# Altium schematic sheet S7CAS-PLEIADES-CARTE-MERE_Pxx_PHY.SchDoc
size Tabloid; SheetNumber: 9; SheetTotal: 18; Sheet_Name: PHY; Size: 11x17
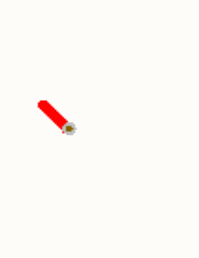
[diagram p0: S7CAS-PLEIADES-CARTE-MERE_Pxx_PHY.SchDoc, left]
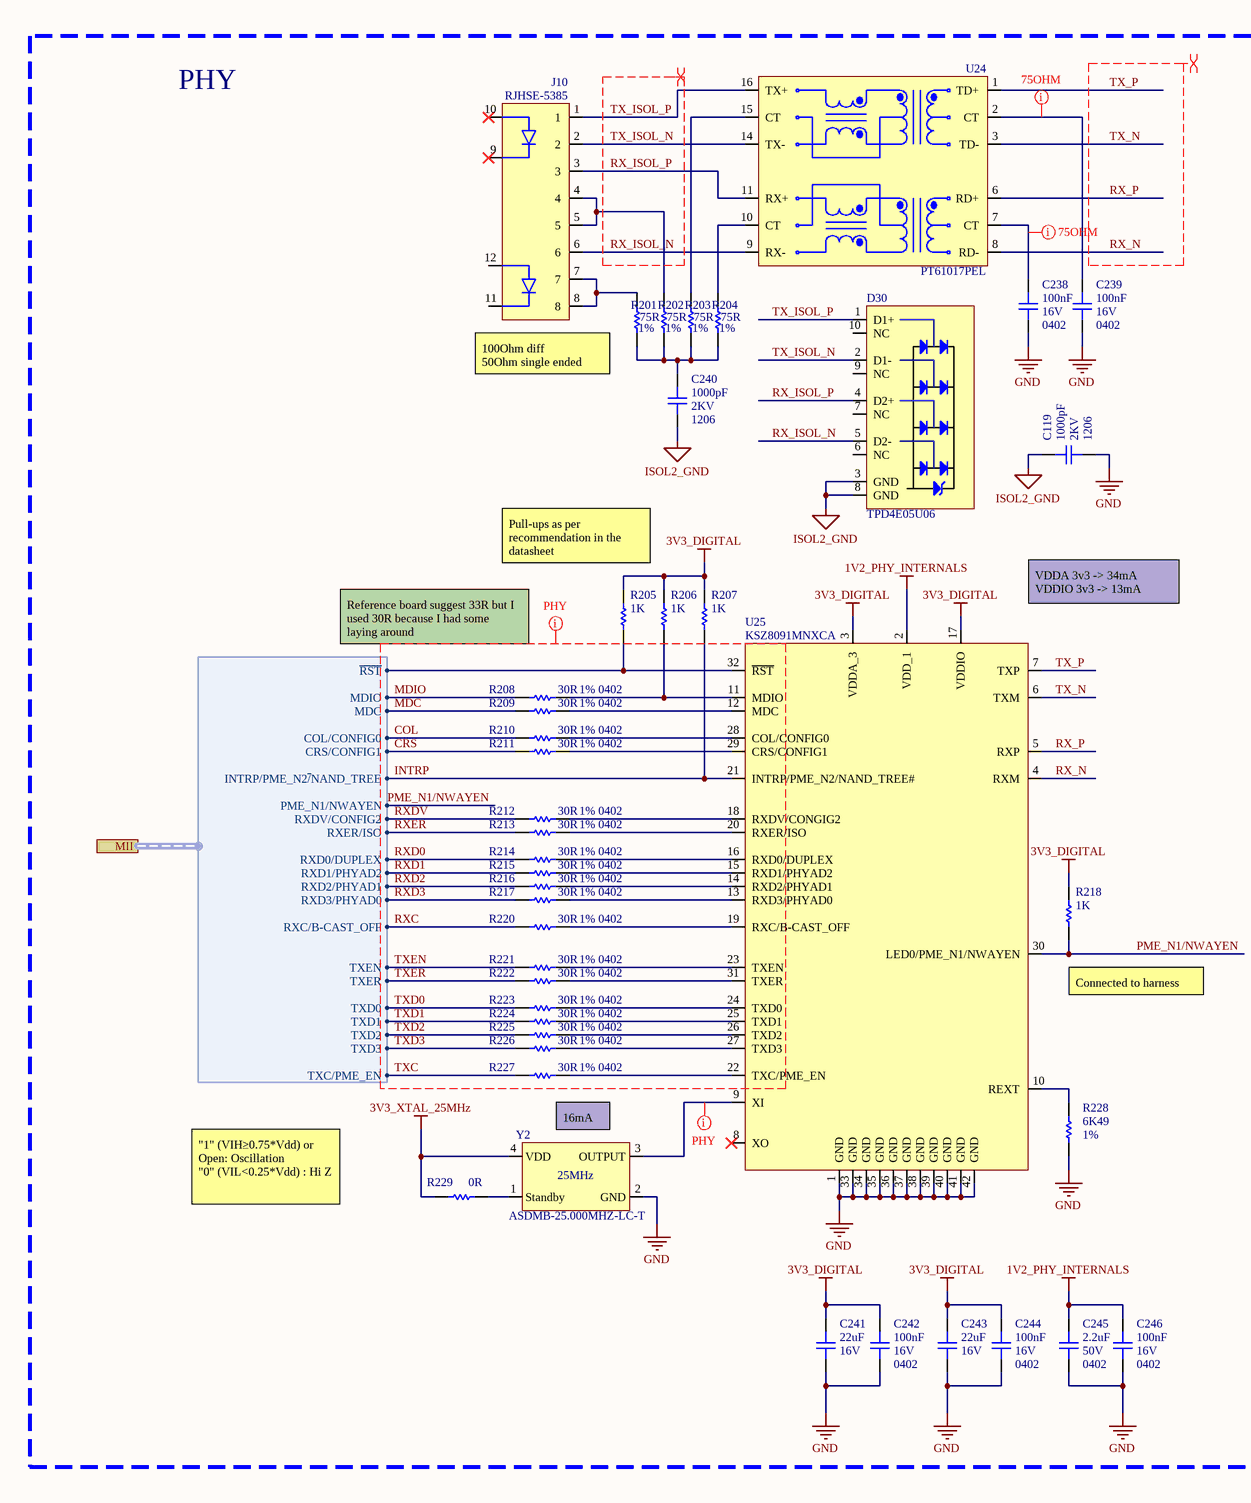
[diagram p1: S7CAS-PLEIADES-CARTE-MERE_Pxx_PHY.SchDoc, middle]
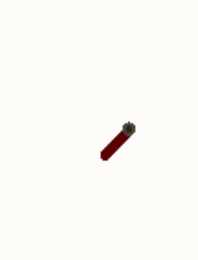
[diagram p2: S7CAS-PLEIADES-CARTE-MERE_Pxx_PHY.SchDoc, right]

## Parts
C119  value 1000pF  Voltage: 2KV  Package: 1206  [CAP_1206]  (hidden comment: CAP - 1206)
C238  value 100nF  Voltage: 16V  [CAP_0402]  (hidden comment: 0402)
C239  value 100nF  Voltage: 16V  [CAP_0402]  (hidden comment: 0402)
C240  value 1000pF  Voltage: 2KV  Package: 1206  [CAP_1206]  (hidden comment: CAP - 1206)
C241  value 22uF  Voltage: 16V  [CAP_1206]  (hidden comment: CAP - 1206)
C242  value 100nF  Voltage: 16V  [CAP_0402]  (hidden comment: 0402)
C243  value 22uF  Voltage: 16V  [CAP_1206]  (hidden comment: CAP - 1206)
C244  value 100nF  Voltage: 16V  [CAP_0402]  (hidden comment: 0402)
C245  value 2.2uF  Voltage: 50V  [CAP_0402]  (hidden comment: 0402)
C246  value 100nF  Voltage: 16V  [CAP_0402]  (hidden comment: 0402)
D30  TPD4E05U06  [TVS_DATA_TPD4E05U06]
J10  RJHSE-5385  [CONN_ETHERNET_RJHSE-5385]
R201  value 75R  Precision: 1%  [RES_0402]  (hidden comment: RES - 0603)
R202  value 75R  Precision: 1%  [RES_0402]  (hidden comment: RES - 0603)
R203  value 75R  Precision: 1%  [RES_0402]  (hidden comment: RES - 0603)
R204  value 75R  Precision: 1%  [RES_0402]  (hidden comment: RES - 0603)
R205  value 1K  [RES_0402]  (hidden comment: RES - 0603)
R206  value 1K  [RES_0402]  (hidden comment: RES - 0603)
R207  value 1K  [RES_0402]  (hidden comment: RES - 0603)
R208  value 30R  Package: 0402  Precision: 1%  [RES_0402]  (hidden comment: RES - 0603)
R209  value 30R  Package: 0402  Precision: 1%  [RES_0402]  (hidden comment: RES - 0603)
R210  value 30R  Package: 0402  Precision: 1%  [RES_0402]  (hidden comment: RES - 0603)
R211  value 30R  Package: 0402  Precision: 1%  [RES_0402]  (hidden comment: RES - 0603)
R212  value 30R  Package: 0402  Precision: 1%  [RES_0402]  (hidden comment: RES - 0603)
R213  value 30R  Package: 0402  Precision: 1%  [RES_0402]  (hidden comment: RES - 0603)
R214  value 30R  Package: 0402  Precision: 1%  [RES_0402]  (hidden comment: RES - 0603)
R215  value 30R  Package: 0402  Precision: 1%  [RES_0402]  (hidden comment: RES - 0603)
R216  value 30R  Package: 0402  Precision: 1%  [RES_0402]  (hidden comment: RES - 0603)
R217  value 30R  Package: 0402  Precision: 1%  [RES_0402]  (hidden comment: RES - 0603)
R218  value 1K  [RES_0402]  (hidden comment: RES - 0603)
R220  value 30R  Package: 0402  Precision: 1%  [RES_0402]  (hidden comment: RES - 0603)
R221  value 30R  Package: 0402  Precision: 1%  [RES_0402]  (hidden comment: RES - 0603)
R222  value 30R  Package: 0402  Precision: 1%  [RES_0402]  (hidden comment: RES - 0603)
R223  value 30R  Package: 0402  Precision: 1%  [RES_0402]  (hidden comment: RES - 0603)
R224  value 30R  Package: 0402  Precision: 1%  [RES_0402]  (hidden comment: RES - 0603)
R225  value 30R  Package: 0402  Precision: 1%  [RES_0402]  (hidden comment: RES - 0603)
R226  value 30R  Package: 0402  Precision: 1%  [RES_0402]  (hidden comment: RES - 0603)
R227  value 30R  Package: 0402  Precision: 1%  [RES_0402]  (hidden comment: RES - 0603)
R228  value 6K49  Precision: 1%  [RES_0402]  (hidden comment: RES - 0402)
R229  value 0R  [RES_0402]  (hidden comment: RES - 0603)
U24  PT61017PEL  [ISO_PT61017PEL]
U25  KSZ8091MNXCA  [COM_ETH_PHY_KSZ8091MNXCA]
Y2  ASDMB-25.000MHZ-LC-T  [OSC_ASDMB-25.000MHZ-LC-T]

## Blocks framed on the sheet
PHY: C119 C238-C246 D30 J10 R201-R218 R220-R229 U24 U25 Y2

## Ports
MII (harness MII - Harness, see S7CAS-PLEIADES-CARTE-MERE_Pxx_FPGA_bank0_1_5[1B])

## Harnesses
MII - Harness: ~{RST}, MDIO, MDC, COL/CONFIG0, CRS/CONFIG1, INTRP/PME_N2~{/}NAND_TREE, PME_N1/NWAYEN, RXDV/CONFIG2, RXER/ISO, RXD0/DUPLEX, RXD1/PHYAD2, RXD2/PHYAD1, RXD3/PHYAD0, RXC/B-CAST_OFF, TXEN, TXER, TXD0, TXD1, TXD2, TXD3, TXC/PME_EN

## Nets
1V2_PHY_INTERNALS: C245.2 C246.2 U25.2(VDD_1)
3V3_DIGITAL: C241.2 C242.2 C243.2 C244.2 R205.2 R206.2 R207.2 R218.2 U25.3(VDDA_3) U25.17(VDDIO)
3V3_XTAL_25MHz: R229.2 Y2.4(VDD)
GND: C119.1 C238.1 C239.1 C241.1 C242.1 C243.1 C244.1 C245.1 C246.1 R228.1 U25.1(GND) U25.33(GND) U25.34(GND) U25.35(GND) U25.36(GND) U25.37(GND) U25.38(GND) U25.39(GND) U25.40(GND) U25.41(GND) U25.42(GND) Y2.2(GND)
ISOL2_GND: C119.2 C240.1 D30.3(GND) D30.8(GND)
COL: R210.1 ; port MII.COL/CONFIG0
CRS: R211.1 ; port MII.CRS/CONFIG1
INTRP: R207.1 U25.21(INTRP/PME_N2/NAND_TREE#) ; port MII.INTRP/PME_N2~{/}NAND_TREE
MDC: R209.1 ; port MII.MDC
MDIO: R208.1 ; port MII.MDIO
PME_N1/NWAYEN: R218.1 U25.30(LED0/PME_N1/NWAYEN) ; port MII.PME_N1/NWAYEN
RX_ISOL_N: D30.5(D2-) J10.6 U24.9(RX-)
RX_ISOL_P: D30.4(D2+) J10.3 U24.11(RX+)
RX_N: U24.8(RD-) U25.4(RXM)
RX_P: U24.6(RD+) U25.5(RXP)
RXC: R220.1 ; port MII.RXC/B-CAST_OFF
RXD0: R214.1 ; port MII.RXD0/DUPLEX
RXD1: R215.1 ; port MII.RXD1/PHYAD2
RXD2: R216.1 ; port MII.RXD2/PHYAD1
RXD3: R217.1 ; port MII.RXD3/PHYAD0
RXDV: R212.1 ; port MII.RXDV/CONFIG2
RXER: R213.1 ; port MII.RXER/ISO
TX_ISOL_N: D30.2(D1-) J10.2 U24.14(TX-)
TX_ISOL_P: D30.1(D1+) J10.1 U24.16(TX+)
TX_N: U24.3(TD-) U25.6(TXM)
TX_P: U24.1(TD+) U25.7(TXP)
TXC: R227.1 ; port MII.TXC/PME_EN
TXD0: R223.1 ; port MII.TXD0
TXD1: R224.1 ; port MII.TXD1
TXD2: R225.1 ; port MII.TXD2
TXD3: R226.1 ; port MII.TXD3
TXEN: R221.1 ; port MII.TXEN
TXER: R222.1 ; port MII.TXER
NetC238_2: C238.2 U24.7(CT)
NetC239_2: C239.2 U24.2(CT)
NetC240_2: C240.2 R201.1 R202.1 R203.1 R204.1
NetJ10_4: J10.4 J10.5 R202.2
NetJ10_7: J10.7 J10.8 R201.2
NetR203_2: R203.2 U24.15(CT)
NetR204_2: R204.2 U24.10(CT)
NetR205_1: R205.1 U25.32(~{RST}) ; port MII.~{RST}
NetR206_1: R206.1 R208.2 U25.11(MDIO)
NetR209_2: R209.2 U25.12(MDC)
NetR210_2: R210.2 U25.28(COL/CONFIG0)
NetR211_2: R211.2 U25.29(CRS/CONFIG1)
NetR212_2: R212.2 U25.18(RXDV/CONGIG2)
NetR213_2: R213.2 U25.20(RXER/ISO)
NetR214_2: R214.2 U25.16(RXD0/DUPLEX)
NetR215_2: R215.2 U25.15(RXD1/PHYAD2)
NetR216_2: R216.2 U25.14(RXD2/PHYAD1)
NetR217_2: R217.2 U25.13(RXD3/PHYAD0)
NetR220_2: R220.2 U25.19(RXC/B-CAST_OFF)
NetR221_2: R221.2 U25.23(TXEN)
NetR222_2: R222.2 U25.31(TXER)
NetR223_2: R223.2 U25.24(TXD0)
NetR224_2: R224.2 U25.25(TXD1)
NetR225_2: R225.2 U25.26(TXD2)
NetR226_2: R226.2 U25.27(TXD3)
NetR227_2: R227.2 U25.22(TXC/PME_EN)
NetR228_2: R228.2 U25.10(REXT)
NetR229_1: R229.1 Y2.1(Standby)
NetU25_9: U25.9(XI) Y2.3(OUTPUT)

Not connected (* = marked no-connect by the designer): D30 6(NC) 7(NC) 9(NC) 10(NC); J10 9(LED1_K)* 10(LED1_A)* 11(LED2_K) 12(LED2_A); U25 8(XO)*

## Layout directives
differential pair; differential pair class ETH_DIFF_PAIR; differential pair class ETH75OHM; net class eth_diff: RX_N, RX_P, TX_N, TX_P
differential pair; differential pair class ETH_ISOL_DIFF_PAIR; differential pair class ETH75OHM; net class eth_diff: RX_ISOL_N, RX_ISOL_P, TX_ISOL_N, TX_ISOL_P
net class MII_TRANSMISSION_LINE: COL, CRS, INTRP, MDC, MDIO, NetU25_9, PME_N1/NWAYEN, RXC, RXD0, RXD1, RXD2, RXD3, RXDV, RXER, TXC, TXD0, TXD1, TXD2, TXD3, TXEN, TXER
net class 75OHM: NetC238_2, NetC239_2

## Notes on the sheet
- 100Ohm diff
  50Ohm single ended
- Pull-ups as per recommendation in the datasheet
- Reference board suggest 33R but I used 30R because I had some laying around
- (near U25) VDDA 3v3 -> 34mA
  VDDIO 3v3 -> 13mA
- Connected to harness
- 16mA
- "1" (VIH≥0.75*Vdd) or Open: Oscillation
  "0" (VIL<0.25*Vdd) : Hi Z
- Sheet Name
- Project Title
- Global Project
- Size
- Group
- Revision
- Date
- Sheet
- of
- Filename
- Designers

## Library data of the parts
C119 C240 C241 C243 = CAP - 1206: Precision: 10%; Current: *; CreatedBy: Jonathan Bouchard; Power: *; Supplier 1: Arrow Electronics
  C119 C240: Supplier Part Number 1: 1206GC102KAT1A
  C241 C243: Package: 1206; Supplier Part Number 1: CL31A226MOCLNNC
C238 C239 C242 C244-C246 = CAP - 0603: CAP - 0402; Precision: 10%; Current: *; CreatedBy: Jonathan Bouchard; Power: *; Package: 0402; Supplier 1: Arrow Electronics
  C238 C239 C242 C244 C246: Supplier Part Number 1: CL10B104KO8NNNC
  C245: Supplier Part Number 1: GRM188R61H225KE11D
D30 = TVS_DATA_TPD4E05U06: TVS - TVS DIODE 5.5VWM 14VC - 10SON; Manufacturer #1: Texas Instruments; Part Number #1: TPD4E05U06DQAR; Current Rating: 2.5A (8/20µs); Power Max: 40 W (peak); Value: 4 unidirectionnal channels; Voltage rating: 6V (Breakdown); Polarized: YES; Magnetic Material: UNKNOWN; GRAMS Lib Spec: 2.8; Manufacturer #2: *; Part Number #2: *; HelpURL: http://www.ti.com/lit/ds/symlink/tpd4e05u06.pdf; Supplier 1: Digi-Key; Supplier Part Number 1: 296-35765-1-ND; Note: *; Assembly Type: SMD; Temperature: -40°C ~ 125°C; Package: 10-USON; CreatedBy/Date: Olivier Bernard / 12/3/2018; Tolerance: *; VerifiedBy: Caroline Paulin / 4 juillet 2018; Cryo: UNKNOWN
J10 = CONN_ETHERNET_RJHSE-5385: CONN - MOD JACK RJ45 R/A ETHERNET - TH; Mfg: Amphenol; Voltage: *; Current: *; Power: *; Mfg Part Number: RJHSE-5385; HelpURL: https://www.amphenolcanada.com/ProductSearch/drawings/AC/RJHSE538X.pdf; CreatedBy: Jonathan Bouchard; Temperature: -55°C ~ 85°C; Value: *; Precision: *; Package: TH-12; Supplier 1: Digikey; Supplier Part Number 1: RJHSE-5385-ND
R201-R204 R208-R217 R220-R227 = RES - 0603: RES - 0402; Current: *; CreatedBy: Jonathan Bouchard; Supplier 1: Arrow Electronics
  R201-R204: Package: 0402; Supplier Part Number 1: RMCF0603FT75R0
  R208-R217 R220-R227: Supplier Part Number 1: RMCF0603FT30R0
R205-R207 R218 R229 = RES - 0603: RES - 0402; Precision: 1%; Current: *; CreatedBy: Jonathan Bouchard; Package: 0402; Supplier 1: Arrow Electronics
  R205-R207 R218: Supplier Part Number 1: RMCF0603FT1K00
  R229: Supplier Part Number 1: RMCF0603ZT0R00
R228 = RES - 0402: Voltage: 50V; Power: 1/16W; Current: *; CreatedBy: Jonathan Bouchard; Package: 0402; Supplier 1: Mouser; Supplier Part Number 1: 652-CR0402-FX6491GLF
U24 = ISO_PT61017PEL: ISO - 350µH LAN 10/100 Base-T Pulse Transformer 1CT:1CT Surface Mount; GRAMS Lib Spec: 2.7; Supplier 1: Arrow Electronics; Supplier Part Number 1: PT61017PEL
U25 = COM_ETH_PHY_KSZ8091MNXCA: COM - ETHERNET PHY 10/100 - QFN-32; Voltage: 1.8V, 2.5V, 3.3V; Mfg: Micrel; Current: *; Power: *; Mfg Part Number: KSZ8091MNXCA; HelpURL: http://ww1.microchip.com/downloads/en/DeviceDoc/00002275A.pdf; CreatedBy: Jonathan Bouchard; Temperature: 0°C ~ 70°C; Value: *; Precision: *; Package: QFN-32; Supplier 1: Digikey; Supplier Part Number 1: 576-4356-ND
Y2 = OSC_ASDMB-25.000MHZ-LC-T: OSC - 25MHz XO (Standard) LVCMOS - 4-SMD, No Lead; Manufacturer #1: Abracon LLC; Tolerance: ±50ppm; Voltage Rating: 1.8V ~ 3.3V; GRAMS Lib Spec: 2.8; Magnetic Material: Unknown; Polarized: Yes; Value: 25MHz; Current Rating: *; Power Max: *; HelpURL: https://abracon.com/Oscillators/ASDMB.pdf; CreatedBy/Date: Joël Lemay 2019-03-29; VerifiedBy: C. Paulin - 29 mai 2019; Temperature: -40°C ~ +85°C; Package: 4-SMD, No Lead; Manufacturer #2: *; Note: *; Assembly Type: SMD; Part Number #2: *; Part Number #1: ASDMB-25.000MHZ-LC-T; Supplier 1: Digi-Key; Supplier Part Number 1: 535-11730-1-ND; Cryo: UNKNOWN